# Altium project MS1-SEQ.PrjPcb (part 1 of 3)
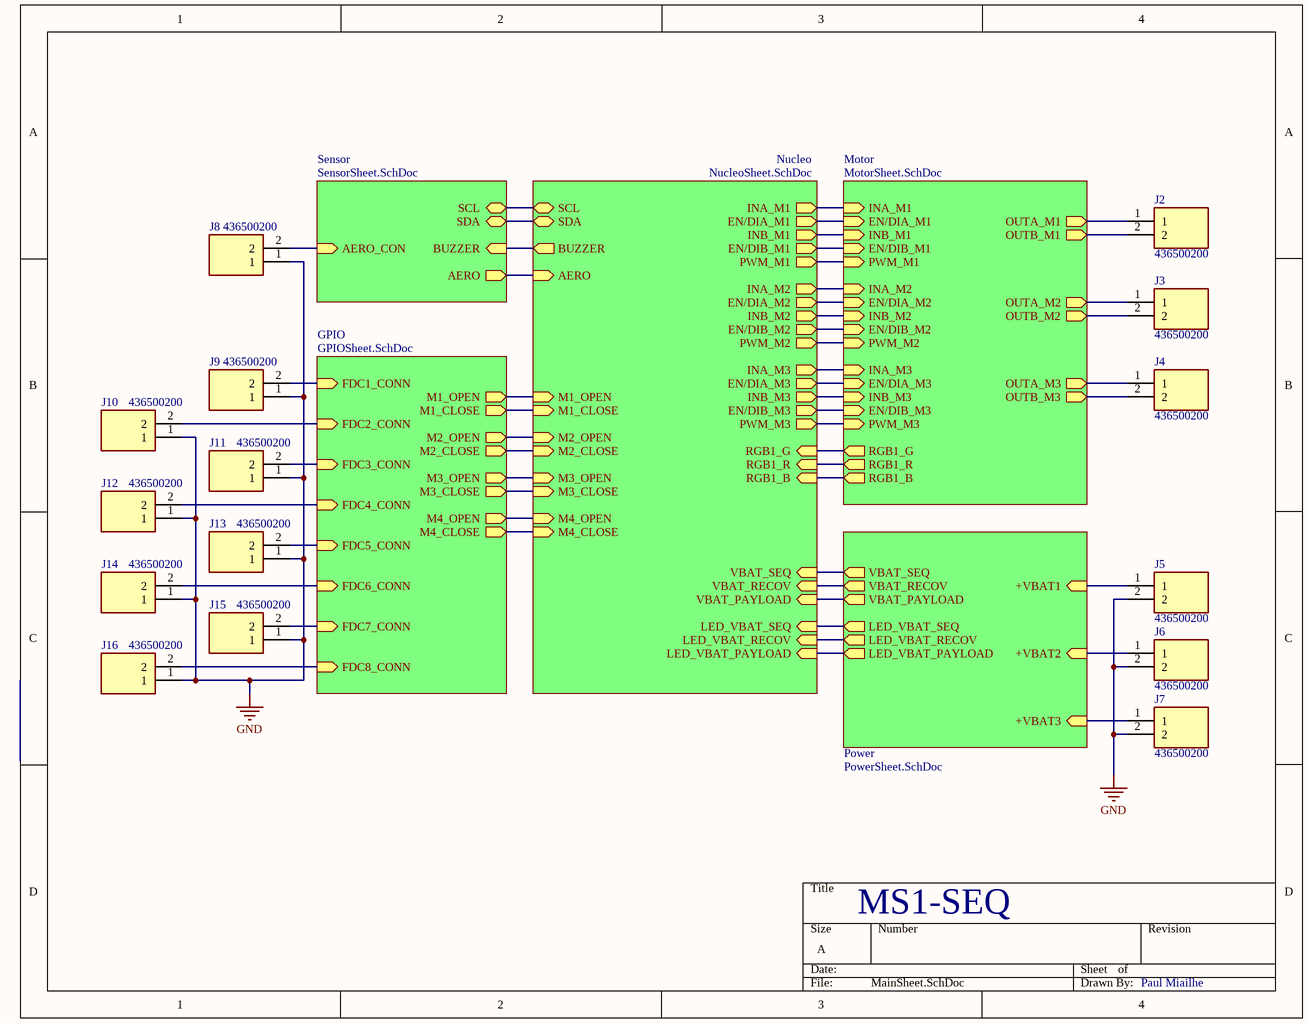
[diagram p0: MainSheet.SchDoc]
6 sheets, 184 parts. Net scope: hierarchical (ports join the sheet entries above them; power ports are global).
Board file: MS1_PCB.PcbDoc
Sheets:
  MainSheet.SchDoc
    Motor = MotorSheet.SchDoc
    Power = PowerSheet.SchDoc
    Nucleo = NucleoSheet.SchDoc
    GPIO = GPIOSheet.SchDoc
    Sensor = SensorSheet.SchDoc

## Sheet MainSheet.SchDoc
size A; SheetNumber: 1; SheetTotal: 6

### Parts
J2  436500200  [MOLEX_436500200]
J3  436500200  [MOLEX_436500200]
J4  436500200  [MOLEX_436500200]
J5  436500200  [MOLEX_436500200]
J6  436500200  [MOLEX_436500200]
J7  436500200  [MOLEX_436500200]
J8  436500200  [MOLEX_436500200]
J9  436500200  [MOLEX_436500200]
J10  436500200  [MOLEX_436500200]
J11  436500200  [MOLEX_436500200]
J12  436500200  [MOLEX_436500200]
J13  436500200  [MOLEX_436500200]
J14  436500200  [MOLEX_436500200]
J15  436500200  [MOLEX_436500200]
J16  436500200  [MOLEX_436500200]

### Sub-sheets
GPIO = GPIOSheet.SchDoc: M1_OPEN (out), M1_CLOSE (out), M2_OPEN (out), M2_CLOSE (out), M3_OPEN (out), M3_CLOSE (out), FDC1_CONN (in), FDC2_CONN (in), FDC3_CONN (in), FDC4_CONN (in), FDC5_CONN (in), FDC6_CONN (in), FDC7_CONN (in), FDC8_CONN (in), M4_CLOSE (out), M4_OPEN (out)
Motor = MotorSheet.SchDoc: INA_M1 (in), EN/DIA_M1 (in), INB_M1 (in), EN/DIB_M1 (in), PWM_M1 (in), INA_M2 (in), EN/DIA_M2 (in), INB_M2 (in), EN/DIB_M2 (in), PWM_M2 (in), INA_M3 (in), EN/DIA_M3 (in), INB_M3 (in), EN/DIB_M3 (in), PWM_M3 (in), RGB1_G (out), RGB1_R (out), RGB1_B (out), OUTA_M1 (out), OUTB_M1 (out), OUTA_M2 (out), OUTB_M2 (out), OUTA_M3 (out), OUTB_M3 (out)
Nucleo = NucleoSheet.SchDoc: EN/DIA_M1 (out), INA_M1 (out), PWM_M1 (out), EN/DIB_M1 (out), INB_M1 (out), INA_M2 (out), EN/DIA_M2 (out), INB_M2 (out), EN/DIB_M2 (out), PWM_M2 (out), INA_M3 (out), EN/DIA_M3 (out), INB_M3 (out), EN/DIB_M3 (out), PWM_M3 (out), RGB1_G (in), RGB1_R (in), RGB1_B (in), VBAT_SEQ (in), VBAT_RECOV (in), VBAT_PAYLOAD (in), LED_VBAT_SEQ (in), LED_VBAT_RECOV (in), LED_VBAT_PAYLOAD (in), M1_OPEN (in), M1_CLOSE (in), M2_OPEN (in), M2_CLOSE (in), M3_OPEN (in), M3_CLOSE (in), SCL (bidir), SDA (bidir), BUZZER (out), AERO (in), M4_OPEN (in), M4_CLOSE (in)
Power = PowerSheet.SchDoc: VBAT_SEQ (out), VBAT_RECOV (out), VBAT_PAYLOAD (out), LED_VBAT_SEQ (out), LED_VBAT_RECOV (out), LED_VBAT_PAYLOAD (out), +VBAT1 (in), +VBAT2 (in), +VBAT3 (in)
Sensor = SensorSheet.SchDoc: SCL (bidir), SDA (bidir), BUZZER (in), AERO (out), AERO_CON (in)

### Nets
GND: J5.2 J6.2 J7.2 J8.1 J9.1 J10.1 J11.1 J12.1 J13.1 J14.1 J15.1 J16.1
OUTA_M1: J2.1 ; sheet Motor/OUTA_M1
OUTA_M2: J3.1 ; sheet Motor/OUTA_M2
OUTA_M3: J4.1 ; sheet Motor/OUTA_M3
OUTB_M1: J2.2 ; sheet Motor/OUTB_M1
OUTB_M2: J3.2 ; sheet Motor/OUTB_M2
OUTB_M3: J4.2 ; sheet Motor/OUTB_M3
SCL: sheet Nucleo/SCL, sheet Sensor/SCL
SDA: sheet Nucleo/SDA, sheet Sensor/SDA
NetC25_2: sheet Power/VBAT_SEQ, sheet Nucleo/VBAT_SEQ
NetC26_2: sheet Power/VBAT_RECOV, sheet Nucleo/VBAT_RECOV
NetC27_2: sheet Power/VBAT_PAYLOAD, sheet Nucleo/VBAT_PAYLOAD
NetF1_1: J5.1 ; sheet Power/+VBAT1
NetF2_1: J6.1 ; sheet Power/+VBAT2
NetF3_1: J7.1 ; sheet Power/+VBAT3
NetJ8_2: J8.2 ; sheet Sensor/AERO_CON
NetJ9_2: J9.2 ; sheet GPIO/FDC1_CONN
NetJ10_2: J10.2 ; sheet GPIO/FDC2_CONN
NetJ11_2: J11.2 ; sheet GPIO/FDC3_CONN
NetJ12_2: J12.2 ; sheet GPIO/FDC4_CONN
NetJ13_2: J13.2 ; sheet GPIO/FDC5_CONN
NetJ14_2: J14.2 ; sheet GPIO/FDC6_CONN
NetJ15_2: J15.2 ; sheet GPIO/FDC7_CONN
NetJ16_2: J16.2 ; sheet GPIO/FDC8_CONN
NetJ101_1: sheet Motor/RGB1_G, sheet Nucleo/RGB1_G
NetJ101_2: sheet Motor/RGB1_R, sheet Nucleo/RGB1_R
NetJ101_13: sheet Nucleo/M4_OPEN, sheet GPIO/M4_OPEN
NetJ101_15: sheet Nucleo/M4_CLOSE, sheet GPIO/M4_CLOSE
NetJ101_17: sheet Motor/RGB1_B, sheet Nucleo/RGB1_B
NetJ101_27: sheet Nucleo/BUZZER, sheet Sensor/BUZZER
NetJ101_31: sheet Nucleo/AERO, sheet Sensor/AERO
NetJ101_32: sheet Nucleo/M3_OPEN, sheet GPIO/M3_OPEN
NetJ101_34: sheet Motor/EN/DIA_M3, sheet Nucleo/EN/DIA_M3
NetJ101_35: sheet Power/LED_VBAT_RECOV, sheet Nucleo/LED_VBAT_RECOV
NetJ101_36: sheet Power/LED_VBAT_SEQ, sheet Nucleo/LED_VBAT_SEQ
NetJ101_37: sheet Power/LED_VBAT_PAYLOAD, sheet Nucleo/LED_VBAT_PAYLOAD
NetJ102_1: sheet Motor/INB_M1, sheet Nucleo/INB_M1
NetJ102_2: sheet Motor/EN/DIA_M1, sheet Nucleo/EN/DIA_M1
NetJ102_4: sheet Motor/PWM_M2, sheet Nucleo/PWM_M2
NetJ102_6: sheet Motor/EN/DIB_M3, sheet Nucleo/EN/DIB_M3
NetJ102_11: sheet Nucleo/M2_CLOSE, sheet GPIO/M2_CLOSE
NetJ102_13: sheet Nucleo/M2_OPEN, sheet GPIO/M2_OPEN
NetJ102_15: sheet Nucleo/M1_CLOSE, sheet GPIO/M1_CLOSE
NetJ102_16: sheet Motor/EN/DIB_M2, sheet Nucleo/EN/DIB_M2
NetJ102_19: sheet Motor/EN/DIB_M1, sheet Nucleo/EN/DIB_M1
NetJ102_21: sheet Motor/PWM_M1, sheet Nucleo/PWM_M1
NetJ102_22: sheet Motor/INA_M3, sheet Nucleo/INA_M3
NetJ102_23: sheet Motor/INA_M1, sheet Nucleo/INA_M1
NetJ102_24: sheet Motor/INB_M3, sheet Nucleo/INB_M3
NetJ102_25: sheet Motor/PWM_M3, sheet Nucleo/PWM_M3
NetJ102_26: sheet Motor/INA_M2, sheet Nucleo/INA_M2
NetJ102_28: sheet Motor/INB_M2, sheet Nucleo/INB_M2
NetJ102_30: sheet Motor/EN/DIA_M2, sheet Nucleo/EN/DIA_M2
NetJ102_34: sheet Nucleo/M1_OPEN, sheet GPIO/M1_OPEN
NetJ102_37: sheet Nucleo/M3_CLOSE, sheet GPIO/M3_CLOSE

### Notes on the sheet
- MS1-SEQ
- Paul Miailhe

### Library data of the parts
J2-J16 = 436500200: MF: {'manufacturer': u'Molex'}; Availability: Unavailable; Price: None; Package: None; Value: *; MP: 436500200

## Sheet MotorSheet.SchDoc
size A4; SheetNumber: 2; SheetTotal: 6
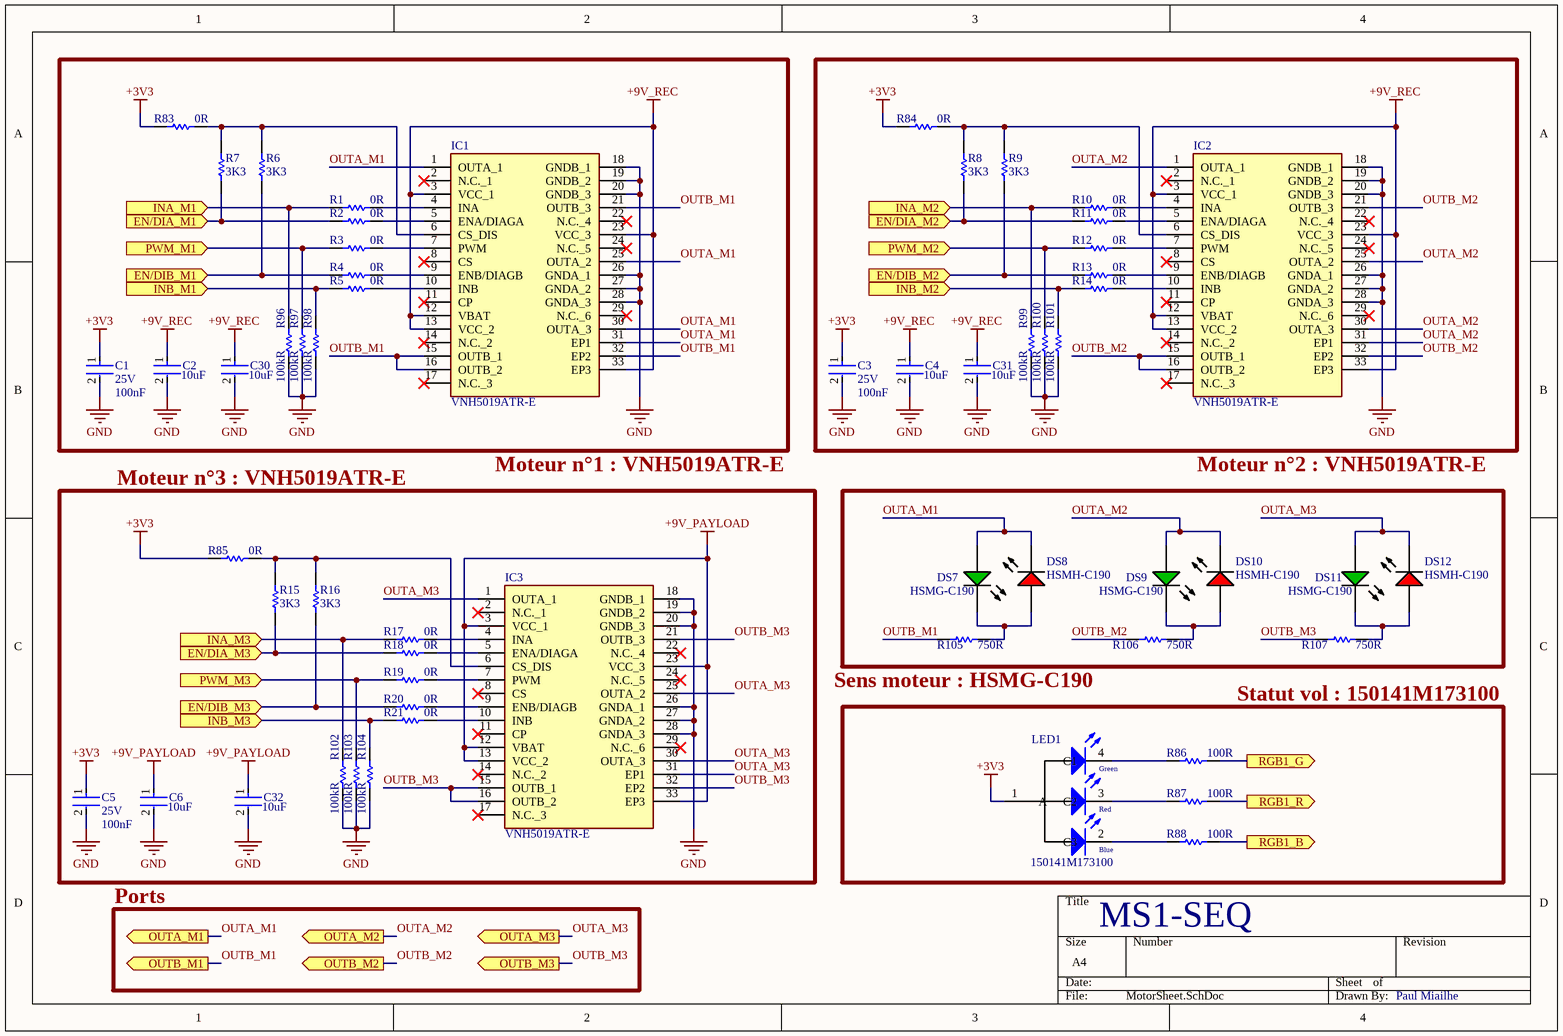
[diagram p1: MotorSheet.SchDoc]

### Parts
C1  Voltage Rating (DC): 25V  Capacitance: 100nF  [FP-CGA3E-0_3-0_1-MFG]  (hidden comment: CGA3E2X7R1E104K080AA)
C2  Capacitance: 10uF  [FP-GRM31C-0_2-e0_3_0_8-MFG]  (hidden comment: GRM31CR71E106KA12L)
C3  Voltage Rating (DC): 25V  Capacitance: 100nF  [FP-CGA3E-0_3-0_1-MFG]  (hidden comment: CGA3E2X7R1E104K080AA)
C4  Capacitance: 10uF  [FP-GRM31C-0_2-e0_3_0_8-MFG]  (hidden comment: GRM31CR71E106KA12L)
C5  Voltage Rating (DC): 25V  Capacitance: 100nF  [FP-CGA3E-0_3-0_1-MFG]  (hidden comment: CGA3E2X7R1E104K080AA)
C6  Capacitance: 10uF  [FP-GRM31C-0_2-e0_3_0_8-MFG]  (hidden comment: GRM31CR71E106KA12L)
C30  Capacitance: 10uF  [FP-GRM31C-0_2-e0_3_0_8-MFG]  (hidden comment: GRM31CR71E106KA12L)
C31  Capacitance: 10uF  [FP-GRM31C-0_2-e0_3_0_8-MFG]  (hidden comment: GRM31CR71E106KA12L)
C32  Capacitance: 10uF  [FP-GRM31C-0_2-e0_3_0_8-MFG]  (hidden comment: GRM31CR71E106KA12L)
DS7  HSMG-C190  [AVAG-HSMX-C190_V]
DS8  HSMH-C190  [AVAG-HSMX-C190_V]
DS9  HSMG-C190  [AVAG-HSMX-C190_V]
DS10  HSMH-C190  [AVAG-HSMX-C190_V]
DS11  HSMG-C190  [AVAG-HSMX-C190_V]
DS12  HSMH-C190  [AVAG-HSMX-C190_V]
IC1  VNH5019ATR-E  [VNH5019A-E_1]
IC2  VNH5019ATR-E  [VNH5019A-E_1]
IC3  VNH5019ATR-E  [VNH5019A-E_1]
LED1  150141M173100  [3528_A]
R1  0R  [RESC1608X55X25ML10T15]
R2  0R  [RESC1608X55X25ML10T15]
R3  0R  [RESC1608X55X25ML10T15]
R4  0R  [RESC1608X55X25ML10T15]
R5  0R  [RESC1608X55X25ML10T15]
R6  3K3  [RESC1608X55X25ML10T15]
R7  3K3  [RESC1608X55X25ML10T15]
R8  3K3  [RESC1608X55X25ML10T15]
R9  3K3  [RESC1608X55X25ML10T15]
R10  0R  [RESC1608X55X25ML10T15]
R11  0R  [RESC1608X55X25ML10T15]
R12  0R  [RESC1608X55X25ML10T15]
R13  0R  [RESC1608X55X25ML10T15]
R14  0R  [RESC1608X55X25ML10T15]
R15  3K3  [RESC1608X55X25ML10T15]
R16  3K3  [RESC1608X55X25ML10T15]
R17  0R  [RESC1608X55X25ML10T15]
R18  0R  [RESC1608X55X25ML10T15]
R19  0R  [RESC1608X55X25ML10T15]
R20  0R  [RESC1608X55X25ML10T15]
R21  0R  [RESC1608X55X25ML10T15]
R83  0R  [RESC1608X55X25ML10T15]
R84  0R  [RESC1608X55X25ML10T15]
R85  0R  [RESC1608X55X25ML10T15]
R86  Resistance: 100R  [RESC1608X55X30LL15T15]  (hidden comment: ERJ-3EKF1000V)
R87  Resistance: 100R  [RESC1608X55X30LL15T15]  (hidden comment: ERJ-3EKF1000V)
R88  Resistance: 100R  [RESC1608X55X30LL15T15]  (hidden comment: ERJ-3EKF1000V)
R96  Resistance: 100kR  [RESC1608X55X30ML20T20]  (hidden comment: ERA3AEB104V)
R97  Resistance: 100kR  [RESC1608X55X30ML20T20]  (hidden comment: ERA3AEB104V)
R98  Resistance: 100kR  [RESC1608X55X30ML20T20]  (hidden comment: ERA3AEB104V)
R99  Resistance: 100kR  [RESC1608X55X30ML20T20]  (hidden comment: ERA3AEB104V)
R100  Resistance: 100kR  [RESC1608X55X30ML20T20]  (hidden comment: ERA3AEB104V)
R101  Resistance: 100kR  [RESC1608X55X30ML20T20]  (hidden comment: ERA3AEB104V)
R102  Resistance: 100kR  [RESC1608X55X30ML20T20]  (hidden comment: ERA3AEB104V)
R103  Resistance: 100kR  [RESC1608X55X30ML20T20]  (hidden comment: ERA3AEB104V)
R104  Resistance: 100kR  [RESC1608X55X30ML20T20]  (hidden comment: ERA3AEB104V)
R105  Resistance: 750R  [RESC1608X55X30ML20T20]  (hidden comment: ERA-3AEB751V)
R106  Resistance: 750R  [RESC1608X55X30ML20T20]  (hidden comment: ERA-3AEB751V)
R107  Resistance: 750R  [RESC1608X55X30ML20T20]  (hidden comment: ERA-3AEB751V)

### Blocks framed on the sheet
Moteur n°3 : VNH5019ATR-E: C5 C6 C32 IC3 R15-R21 R85 R102-R104
Statut vol : 150141M173100: LED1 R86-R88

### Ports
EN/DIA_M1 (in), EN/DIA_M2 (in), EN/DIA_M3 (in), EN/DIB_M1 (in), EN/DIB_M2 (in), EN/DIB_M3 (in), INA_M1 (in), INA_M2 (in), INA_M3 (in), INB_M1 (in), INB_M2 (in), INB_M3 (in), OUTA_M1 (out), OUTA_M2 (out), OUTA_M3 (out), OUTB_M1 (out), OUTB_M2 (out), OUTB_M3 (out), PWM_M1 (in), PWM_M2 (in), PWM_M3 (in), RGB1_B (out), RGB1_G (out), RGB1_R (out)

### Nets
+3V3: C1.1 C3.1 C5.1 LED1.1(A) R83.1 R84.1 R85.1
+9V_PAYLOAD: C6.1 C32.1 IC3.3(VCC_1) IC3.12(VBAT) IC3.13(VCC_2) IC3.23(VCC_3) IC3.33(EP3)
+9V_REC: C2.1 C4.1 C30.1 C31.1 IC1.3(VCC_1) IC1.12(VBAT) IC1.13(VCC_2) IC1.23(VCC_3) IC1.33(EP3) IC2.3(VCC_1) IC2.12(VBAT) IC2.13(VCC_2) IC2.23(VCC_3) IC2.33(EP3)
GND: C1.2 C2.2 C3.2 C4.2 C5.2 C6.2 C30.2 C31.2 C32.2 IC1.18(GNDB_1) IC1.19(GNDB_2) IC1.20(GNDB_3) IC1.26(GNDA_1) IC1.27(GNDA_2) IC1.28(GNDA_3) IC2.18(GNDB_1) IC2.19(GNDB_2) IC2.20(GNDB_3) IC2.26(GNDA_1) IC2.27(GNDA_2) IC2.28(GNDA_3) IC3.18(GNDB_1) IC3.19(GNDB_2) IC3.20(GNDB_3) IC3.26(GNDA_1) IC3.27(GNDA_2) IC3.28(GNDA_3) R96.1 R97.1 R98.1 R99.1 R100.1 R101.1 R102.1 R103.1 R104.1
OUTA_M1: DS7.1(A) DS8.2(K) IC1.1(OUTA_1) IC1.25(OUTA_2) IC1.30(OUTA_3) IC1.31(EP1) ; port OUTA_M1
OUTA_M2: DS9.1(A) DS10.2(K) IC2.1(OUTA_1) IC2.25(OUTA_2) IC2.30(OUTA_3) IC2.31(EP1) ; port OUTA_M2
OUTA_M3: DS11.1(A) DS12.2(K) IC3.1(OUTA_1) IC3.25(OUTA_2) IC3.30(OUTA_3) IC3.31(EP1) ; port OUTA_M3
OUTB_M1: IC1.15(OUTB_1) IC1.16(OUTB_2) IC1.21(OUTB_3) IC1.32(EP2) R105.1 ; port OUTB_M1
OUTB_M2: IC2.15(OUTB_1) IC2.16(OUTB_2) IC2.21(OUTB_3) IC2.32(EP2) R106.1 ; port OUTB_M2
OUTB_M3: IC3.15(OUTB_1) IC3.16(OUTB_2) IC3.21(OUTB_3) IC3.32(EP2) R107.1 ; port OUTB_M3
NetDS7_2: DS7.2(K) DS8.1(A) R105.2
NetDS9_2: DS9.2(K) DS10.1(A) R106.2
NetDS11_2: DS11.2(K) DS12.1(A) R107.2
NetIC1_4: IC1.4(INA) R1.2
NetIC1_5: IC1.5(ENA/DIAGA) R2.2
NetIC1_6: IC1.6(CS_DIS) R6.2 R7.2 R83.2
NetIC1_7: IC1.7(PWM) R3.2
NetIC1_9: IC1.9(ENB/DIAGB) R4.2
NetIC1_10: IC1.10(INB) R5.2
NetIC2_4: IC2.4(INA) R10.2
NetIC2_5: IC2.5(ENA/DIAGA) R11.2
NetIC2_6: IC2.6(CS_DIS) R8.2 R9.2 R84.2
NetIC2_7: IC2.7(PWM) R12.2
NetIC2_9: IC2.9(ENB/DIAGB) R13.2
NetIC2_10: IC2.10(INB) R14.2
NetIC3_4: IC3.4(INA) R17.2
NetIC3_5: IC3.5(ENA/DIAGA) R18.2
NetIC3_6: IC3.6(CS_DIS) R15.2 R16.2 R85.2
NetIC3_7: IC3.7(PWM) R19.2
NetIC3_9: IC3.9(ENB/DIAGB) R20.2
NetIC3_10: IC3.10(INB) R21.2
NetJ101_1: R86.1 ; port RGB1_G
NetJ101_2: R87.1 ; port RGB1_R
NetJ101_17: R88.1 ; port RGB1_B
NetJ101_34: R15.1 R18.1 ; port EN/DIA_M3
NetJ102_1: R5.1 R98.2 ; port INB_M1
NetJ102_2: R2.1 R7.1 ; port EN/DIA_M1
NetJ102_4: R12.1 R100.2 ; port PWM_M2
NetJ102_6: R16.1 R20.1 ; port EN/DIB_M3
NetJ102_16: R9.1 R13.1 ; port EN/DIB_M2
NetJ102_19: R4.1 R6.1 ; port EN/DIB_M1
NetJ102_21: R3.1 R97.2 ; port PWM_M1
NetJ102_22: R17.1 R102.2 ; port INA_M3
NetJ102_23: R1.1 R96.2 ; port INA_M1
NetJ102_24: R21.1 R104.2 ; port INB_M3
NetJ102_25: R19.1 R103.2 ; port PWM_M3
NetJ102_26: R10.1 R99.2 ; port INA_M2
NetJ102_28: R14.1 R101.2 ; port INB_M2
NetJ102_30: R8.1 R11.1 ; port EN/DIA_M2
NetLED1_2: LED1.2(C3) R88.2
NetLED1_3: LED1.3(C2) R87.2
NetLED1_4: LED1.4(C1) R86.2

Not connected (* = marked no-connect by the designer): IC1 2(N.C._1)* 8(CS)* 11(CP)* 14(N.C._2)* 17(N.C._3)* 22(N.C._4)* 24(N.C._5)* 29(N.C._6)*; IC2 2(N.C._1)* 8(CS)* 11(CP)* 14(N.C._2)* 17(N.C._3)* 22(N.C._4)* 24(N.C._5)* 29(N.C._6)*; IC3 2(N.C._1)* 8(CS)* 11(CP)* 14(N.C._2)* 17(N.C._3)* 22(N.C._4)* 24(N.C._5)* 29(N.C._6)*

### Notes on the sheet
- Moteur n°1 : VNH5019ATR-E
- Moteur n°2 : VNH5019ATR-E
- (near R105) Sens moteur : HSMG-C190
- Ports
- MS1-SEQ
- Paul Miailhe
- (in symbol CMP-1431-00001-1) Green; Red; Blue

### Library data of the parts
C1 C3 C5 = CMP-08246-002186-1: Cap Ceramic 100nF 25V X7R 10% Pad SMD 0603 +125°C Automotive T/R; Manufacturer: TDK; Composition: Ceramic; Dielectric: X7R; Ratings: AEC-Q200; Length: 1.6mm; REACH SVHC: No SVHC; Width: 0.031inch; Packaging: Tape and Reel; Case/Package: 0603; Height: 0.8mm; Termination: SMD/SMT; Max Operating Temperature: 125°C; Thickness: 0.035inch; Case Code (Metric): 1608; Lead Free: Lead Free; Mount: Surface Mount; Voltage Rating: 25V; Tolerance: 10%; Weight: 7.1E-05oz; Min Operating Temperature: -55°C; Package Quantity: 1; Depth: 0.8mm; Case Code (Imperial): 0603; Supplier 1: Mouser; Supplier Part Number 1: 810-CGA3E2X7R1E104K; Manufacturer Part Number: CGA3E2X7R1E104K080AA; RoHS: Yes; Category: Ceramic Capacitors; Stock 1: 488891; Pricing 1: 1=0,12000, 10=0,05600, 50=0,05600, 100=0,02500, 1000=0,01400, 10000=0,01000 (USD); Series: CGA; Resistor Type: Ceramic; RoHS Compliant: Yes; ComponentLink1URL: https://datasheet.ciiva.com/24220/cga3e2x7r1e104k080aa-265934-24220022.pdf?src-supplier=Mouser; ComponentLink1Description: https://datasheet.ciiva.com/24220/cga3e2x7r1e104k080aa-265934-24220022.pdf?src-supplier=Mouser; ComponentLink2URL: https://datasheet.ciiva.com/22725/1735392-22725638.pdf?src-supplier=Element14; ComponentLink2Description: https://datasheet.ciiva.com/22725/1735392-22725638.pdf?src-supplier=Element14; ComponentLink3URL: https://datasheet.ciiva.com/22725/1735392-22725639.pdf?src-supplier=Element14; ComponentLink3Description: https://datasheet.ciiva.com/22725/1735392-22725639.pdf?src-supplier=Element14; ComponentLink4URL: https://datasheet.ciiva.com/16427/mlccspec-automotive-general-midvoltage-en-16427320.pdf?src-supplier=Future+Electronics; ComponentLink4Description: https://datasheet.ciiva.com/16427/mlccspec-automotive-general-midvoltage-en-16427320.pdf?src-supplier=Future+Electronics; ComponentLink5URL: https://datasheet.ciiva.com/23803/1735392-23803082.pdf?src-supplier=Newark; ComponentLink5Description: https://datasheet.ciiva.com/23803/1735392-23803082.pdf?src-supplier=Newark
C2 C4 C6 C30-C32 = CMP-06035-003589-1: Chip Multilayer Ceramic Capacitors for General Purpose, 1206, 10uF, X7R, 15%, 10%, 25V; Manufacturer: Murata; Description: CAP CER 10UF 25V 10% X7R 1206; Case Code (Imperial): 1206; Voltage Rating (DC): 25V; Voltage Rating: 25V; Length: 3.2mm; Lead Free: Lead Free; Thickness: 0.071inch; Package Quantity: 1; Width: 1.6mm; Max Operating Temperature: 125°C; Number of Pins: 2; Height: 1.6mm; Case Code (Metric): 3216; REACH SVHC: No SVHC; Radiation Hardening: No; Case/Package: 1206; Material: Ceramic; Tolerance: 10%; Voltage: 25V; Mount: Surface Mount; Packaging: Tape and Reel; Dielectric: X7R; Termination: SMD/SMT; Min Operating Temperature: -55°C; Depth: 1.6mm; Supplier 1: Arrow Electronics; Supplier Part Number 1: GRM31CR71E106KA12L; Manufacturer Part Number: GRM31CR71E106KA12L; RoHS: Yes; Category: Ceramic Capacitors; Stock 1: 64000; Pricing 1: 2000=0.15670 (USD); Series: GRM; Construction: Flat; RoHS Compliant: Yes; ComponentLink1URL: https://datasheet.ciiva.com/22746/415311-22746465.pdf?src-supplier=Element14; ComponentLink1Description: https://datasheet.ciiva.com/22746/415311-22746465.pdf?src-supplier=Element14; ComponentLink2URL: https://datasheet.ciiva.com/22703/1747484-22703378.pdf?src-supplier=Element14; ComponentLink2Description: https://datasheet.ciiva.com/22703/1747484-22703378.pdf?src-supplier=Element14; ComponentLink3URL: https://datasheet.ciiva.com/11789/0900766b80ef921d-11789064.pdf?src-supplier=RSComponents; ComponentLink3Description: https://datasheet.ciiva.com/11789/0900766b80ef921d-11789064.pdf?src-supplier=RSComponents; ComponentLink4URL: https://datasheet.ciiva.com/5418/product-5418961.pdf?src-supplier=Mouser; ComponentLink4Description: https://datasheet.ciiva.com/5418/product-5418961.pdf?src-supplier=Mouser; ComponentLink5URL: https://datasheet.ciiva.com/3777/4378grm31cr71e106ka1223-3777275.pdf?src-supplier=Arrow+Electronics; ComponentLink5Description: https://datasheet.ciiva.com/3777/4378grm31cr71e106ka1223-3777275.pdf?src-supplier=Arrow+Electronics; ComponentLink6URL: https://datasheet.ciiva.com/29202/451104-da-01-de-vs-chip-kond-1206-10-0-uf-10pr-25-0v-x7r-29202596.pdf?src-supplier=Conrad; ComponentLink6Description: https://datasheet.ciiva.com/29202/451104-da-01-de-vs-chip-kond-1206-10-0-uf-10pr-25-0v-x7r-29202596.pdf?src-supplier=Conrad; ComponentLink7URL: https://datasheet.ciiva.com/29199/454935-da-01-en-vs-kondensator-1206-29199424.pdf?src-supplier=Conrad; ComponentLink7Description: https://datasheet.ciiva.com/29199/454935-da-01-en-vs-kondensator-1206-29199424.pdf?src-supplier=Conrad; ComponentLink8URL: https://datasheet.ciiva.com/14116/grmseries-highdielectrictype-eng-14116377.pdf?src-supplier=Distrelec; ComponentLink8Description: https://datasheet.ciiva.com/14116/grmseries-highdielectrictype-eng-14116377.pdf?src-supplier=Distrelec; ComponentLink9URL: https://datasheet.ciiva.com/22774/415311-22774043.pdf?src-supplier=Farnell; ComponentLink9Description: https://datasheet.ciiva.com/22774/415311-22774043.pdf?src-supplier=Farnell; ComponentLink10URL: https://datasheet.ciiva.com/22774/415311-22774044.pdf?src-supplier=Farnell; ComponentLink10Description: https://datasheet.ciiva.com/22774/415311-22774044.pdf?src-supplier=Farnell; ComponentLink11URL: https://datasheet.ciiva.com/6264/partnumbering-e-01-6264460.pdf?src-supplier=Digi-Key; ComponentLink11Description: https://datasheet.ciiva.com/6264/partnumbering-e-01-6264460.pdf?src-supplier=Digi-Key; ComponentLink12URL: https://datasheet.ciiva.com/6264/partnumbering-e-01-6264458.pdf?src-supplier=Digi-Key; ComponentLink12Description: https://datasheet.ciiva.com/6264/partnumbering-e-01-6264458.pdf?src-supplier=Digi-Key; ComponentLink13URL: https://datasheet.ciiva.com/6264/partnumbering-e-01-6264462.pdf?src-supplier=Digi-Key; ComponentLink13Description: https://datasheet.ciiva.com/6264/partnumbering-e-01-6264462.pdf?src-supplier=Digi-Key; ComponentLink14URL: https://datasheet.ciiva.com/16210/partnumbering-e-01-16210776.pdf?src-supplier=Future+Electronics; ComponentLink14Description: https://datasheet.ciiva.com/16210/partnumbering-e-01-16210776.pdf?src-supplier=Future+Electronics
DS7 DS9 DS11 = CMP-1744-00002-1: Chip LED, Green, 2.2 V, -40 to 85 degC, 2-Pin SMD, RoHS, Tape and Reel; Frequency: 400 KHz; Max Supply Voltage: 5.5 V; Access Time: 3500 ns; Clock Frequency: 100 KHz; Case\Package: SOIC; Density: 32 kb; Nominal Supply Current: 2 mA; Interface: Serial; Min Supply Voltage: 1.7 V; Packaging: Tape and Reel; PackageReference: HSMX-C190; ComponentLink2URL: http://docs.avagotech.com/docs/AV02-0551EN; RoHSCompliant: true; Pins: 8; REACH SVHC: No SVHC; Max Operating Temperature: 85 degC; Width: 4 mm; Radiation Hardening: No; Package Quantity: 3000; ComponentLink3Description: Package Specification; ComponentLink1Description: Manufacturer URL; Min Operating Temperature: -40 degC; PackageDescription: 2-Pin Surface Mount Device, Body 1.6 x 0.8 mm, Height 0.9 mm; Max Clock Frequency: 100 KHz; Height: 1.5 mm; ComponentLink1URL: http://www.avagotech.com/; DatasheetVersion: Mar-12; ComponentLink2Description: Datasheet; Mount: Surface Mount; Length: 5 mm; ComponentLink3URL: http://www.fairchildsemi.com/dwg/MA/MA03D.pdf
DS8 DS10 DS12 = CMP-1744-00004-1: LED Uni-Color Red, 65 mW, 20 mA, -40 to 85 degC, 2-Pin SMD, RoHS, Tape and Reel; Connector Type: USB; Gender: Male; Current Rating: 1 A; Length: 7.5 mm; Lead Pitch: 0.65 mm; PackageReference: HSMX-C190; Package Quantity: 2000; Max Operating Temperature: 85 degC; PackageDescription: 2-Pin Surface Mount Device, Body 1.6 x 0.8 mm, Height 0.9 mm; ComponentLink3Description: Package Specification; Mount: Surface Mount; Min Operating Temperature: -30 degC; ComponentLink3URL: http://www.fairchildsemi.com/dwg/MA/MA03D.pdf; ComponentLink1Description: Manufacturer URL; Contact Material: Copper; Pins: 5; Width: 5.6 mm; ComponentLink2Description: Datasheet; RoHSCompliant: true; DatasheetVersion: Mar-12; Height: 2.8 mm; Packaging: Tape and Reel; Contact Plating: Gold; ComponentLink1URL: http://www.avagotech.com/; REACH SVHC: No SVHC; ComponentLink2URL: http://docs.avagotech.com/docs/AV02-0551EN
IC1-IC3 = VNH5019ATR-E: Integrated Circuit; Manufacturer_Name: STMicroelectronics; Datasheet Link: https://www.st.com/resource/en/datasheet/vnh5019a-e.pdf; Manufacturer_Part_Number: VNH5019ATR-E; Mouser Part Number: 511-VNH5019ATR-E; Mouser Price/Stock: https://www.mouser.co.uk/ProductDetail/STMicroelectronics/VNH5019ATR-E?qs=T%2FOtf55vL7cDceYVZzSNKw%3D%3D; Arrow Part Number: VNH5019ATR-E; Arrow Price/Stock: https://www.arrow.com/en/products/vnh5019atr-e/stmicroelectronics
LED1 = CMP-1431-00001-1: SMD Full-Color Top LED, WL-SFTW, Red & Green & Blue; Manufacturer: Wuerth Elektronik; PackageReference: 3528_A; PartNumber: 150141M173100; ComponentLink2Description: Datasheet; ComponentLink1URL: http://www.we-online.com; Color: Red & Green & Blue; ComponentLink1Description: Manufacturer URL; ComponentLink2URL: http://katalog.we-online.com/led/datasheet/150141M173100.pdf
R1-R5 R10-R14 R17-R21 R83-R85 = CMP-2100-03667-1: Chip Resistor, 0 Ohm, +/- 5%, 0.1 W, -55 to 155 degC, 0603 (1608 Metric), RoHS, Tape and Reel; Manufacturer: Yageo; Temperature Coefficient: 200ppm/degreesC; Voltage Rating: 50V; Power Rating: 100mW; Resistance: 0mOhm; Width: 0.8mm; Max Operating Temperature: 155degC; Tolerance: 5%; Package Reference: 0603; Height: 0.45mm; Depth: 0.8mm; Package Description: 2-Pin Surface Mount Device, Body 1.6 x 0.8 mm; Termination: SMD/SMT; Package Quantity: 5000; Case/Package: 0603; Case Code (Imperial): 0603; Radiation Hardening: No; Number of Pins: 2; Length: 1.6mm; Lead Free: LeadFree; Voltage Rating (DC): 50V; Military Standard: Not; Datasheet URL: http://www.yageo.com/NewPortal/yageodocoutput?fileName=/pdf/R-Chip/PYu-RC_Group_51_RoHS_L_5.pdf; Manufacturer URL: http://www.yageo.com/; Packaging: TapeandReel; Case Code (Metric): 1608; Min Operating Temperature: -55degC; Composition: ThickFilm; RoHSCompliant: true; Contact Plating: Tin; Datasheet Version: Rev. 5, 10/2016; REACH SVHC: NoSVHC
R6-R9 R15 R16 = CMP-1012-00567-2: Chip Resistor, 3.3 KOhm, +/- 1%, 0.1 W, -55 to 155 degC, 0603 (1608 Metric), RoHS, Tape and Reel; Manufacturer: Yageo; Temperature Coefficient: 100ppm/degreesC; Voltage Rating: 50V; Max Power Dissipation: 100mW; Resistance: 3.3KOhm; Case Code (Metric): 1608; Case/Package: 0603; Composition: ThickFilm; RoHSCompliant: true; Datasheet Version: Rev. 5, 10/2016; REACH SVHC: NoSVHC; Width: 0.8mm; Package Quantity: 1; Depth: 0.8mm; Voltage Rating (DC): 50V; Termination: SMD/SMT; Length: 1.6mm; Lead Free: LeadFree; Package Description: 2-Pin Surface Mount Device, Body 1.6 x 0.8 mm; Max Operating Temperature: 155degC; Tolerance: 1%; Height: 0.45mm; Number of Pins: 2; Military Standard: Not; Power Rating: 100mW; Datasheet URL: http://www.yageo.com/NewPortal/yageodocoutput?fileName=/pdf/R-Chip/PYu-RC_Group_51_RoHS_L_5.pdf; Case Code (Imperial): 0603; Manufacturer URL: http://www.yageo.com/; Packaging: TapeandReel; Min Operating Temperature: -55degC; Package Reference: 0603; Number of Terminations: 2
R86-R88 = CMP-2000-00179-1: Manufacturer: Panasonic; Manufacturer Part Number: ERJ3EKF1000V; Tolerance: 1%; Power Rating: 100mW; Voltage Rating: 75V; Temperature Coefficient: 100ppm/°C; Part Number: ERJ-3EKF1000V; Supplier 1: RSComponents; Supplier Part Number 1: 1755733; RoHS: Yes; Category: Chip SMD Resistors; Stock 1: 30000; Pricing 1: 5000=0,01000, 10000=0,00800, 15000=0,00800, 20000=0,00800, 5000=0,00700, 10000=0,00600, 15000=0,00600, 20000=0,00600 (USD); Mount: Surface Mount; Number of Pins: 2; Case Code (Imperial): 0603; Case Code (Metric): 1608; Weight: 7.1E-05oz; Contact Plating: Tin; Size Code: 0603; Min Operating Temperature: -55°C; Max Operating Temperature: 155°C; Packaging: Tape and Reel; Termination: SMD/SMT; Resistor Type: Thick Film; Number of Terminations: 2; Series: ERJ; Package Quantity: 5000; Max Power Dissipation: 100mW; Voltage Rating (DC): 75V; Resistance Tolerance: 1%; Construction: Rectangular; Features: Automotive AEC-Q200; Length: 1.6mm; Width: 0.8mm; Height: 0.45mm; Depth: 0.8mm; Radiation Hardening: No; REACH SVHC: No SVHC; RoHS Compliant: Yes; Military Standard: Not; Lead Free: Lead Free; ComponentLink1URL: https://datasheet.ciiva.com/34303/1987450-34303565.pdf?src-supplier=Jameco; ComponentLink1Description: https://datasheet.ciiva.com/34303/1987450-34303565.pdf?src-supplier=Jameco; ComponentLink2URL: https://datasheet.ciiva.com/7830/aoa0000ce2-7830728.pdf?src-supplier=Element14; ComponentLink2Description: https://datasheet.ciiva.com/7830/aoa0000ce2-7830728.pdf?src-supplier=Element14; ComponentLink3URL: https://datasheet.ciiva.com/46372/1678782-46372726.pdf?src-supplier=Element14; ComponentLink3Description: https://datasheet.ciiva.com/46372/1678782-46372726.pdf?src-supplier=Element14; ComponentLink4URL: https://datasheet.ciiva.com/22667/1678782-22667887.pdf?src-supplier=Element14; ComponentLink4Description: https://datasheet.ciiva.com/22667/1678782-22667887.pdf?src-supplier=Element14; ComponentLink5URL: https://datasheet.ciiva.com/46372/1678782-46372727.pdf?src-supplier=Element14; ComponentLink5Description: https://datasheet.ciiva.com/46372/1678782-46372727.pdf?src-supplier=Element14; ComponentLink6URL: https://datasheet.ciiva.com/24159/aoa0000ce2-24159753.pdf?src-supplier=Mouser; ComponentLink6Description: https://datasheet.ciiva.com/24159/aoa0000ce2-24159753.pdf?src-supplier=Mouser; ComponentLink7URL: https://datasheet.ciiva.com/16762/70260748-16762666.pdf?src-supplier=Allied+Electronics; ComponentLink7Description: https://datasheet.ciiva.com/16762/70260748-16762666.pdf?src-supplier=Allied+Electronics; ComponentLink8URL: https://datasheet.ciiva.com/16765/70260748-16765766.pdf?src-supplier=Allied+Electronics; ComponentLink8Description: https://datasheet.ciiva.com/16765/70260748-16765766.pdf?src-supplier=Allied+Electronics; ComponentLink9URL: https://datasheet.ciiva.com/9186/aoa0000ce2-9186725.pdf?src-supplier=Avnet; ComponentLink9Description: https://datasheet.ciiva.com/9186/aoa0000ce2-9186725.pdf?src-supplier=Avnet; ComponentLink10URL: https://datasheet.ciiva.com/48530/aoa0000ce2-48530986.pdf?src-supplier=Avnet; ComponentLink10Description: https://datasheet.ciiva.com/48530/aoa0000ce2-48530986.pdf?src-supplier=Avnet; ComponentLink11URL: https://datasheet.ciiva.com/30088/aoa0000ce2-30088649.pdf?src-supplier=Onlinecomponents.com; ComponentLink11Description: https://datasheet.ciiva.com/30088/aoa0000ce2-30088649.pdf?src-supplier=Onlinecomponents.com; ComponentLink12URL: https://datasheet.ciiva.com/17207/aoa0000ce2-17207983.pdf?src-supplier=Avnet+Europe; ComponentLink12Description: https://datasheet.ciiva.com/17207/aoa0000ce2-17207983.pdf?src-supplier=Avnet+Europe
R96-R104 = CMP-2000-00875-1: Manufacturer: Panasonic; Manufacturer Part Number: ERA-3AEB104V; Tolerance: 0.1%; Temperature Coefficient: 25ppm/°C; Voltage Rating: 75V; Power Rating: 100mW; Part Number: ERA3AEB104V; Supplier 1: RSComponents; Supplier Part Number 1: 0566787; RoHS: Yes; Category: Chip SMD Resistors; Stock 1: 29; Pricing 1: 5=0.39000, 50=0.36200, 100=0.33800, 250=0.31600, 500=0.28800 (GBP); Mount: Surface Mount; Case/Package: 0603; Number of Pins: 2; Case Code (Metric): 1608; Case Code (Imperial): 0603; Contact Plating: Tin; Min Operating Temperature: -55°C; Max Operating Temperature: 155°C; Packaging: Tape and Reel; Package Quantity: 5000; Resistance Tolerance: 0.1%; Resistor Type: Thin Film; Termination: SMD/SMT; Number of Terminations: 2; Max Power Dissipation: 100mW; Features: Automotive AEC-Q200; Series: ERA; Construction: Rectangular; Technology: THIN FILM; Working Voltage: 75V; Length: 1.6mm; Width: 0.8mm; Height: 0.45mm; Depth: 0.8mm; Radiation Hardening: No; REACH SVHC: No SVHC; RoHS Compliant: Yes; Military Standard: Not; ComponentLink1URL: https://datasheet.ciiva.com/11808/0900766b80fe20f7-11808030.pdf?src-supplier=RSComponents; ComponentLink1Description: https://datasheet.ciiva.com/11808/0900766b80fe20f7-11808030.pdf?src-supplier=RSComponents; ComponentLink2URL: https://datasheet.ciiva.com/29183/451655-da-01-en-widerstand-0603-era-29183868.pdf?src-supplier=Conrad; ComponentLink2Description: https://datasheet.ciiva.com/29183/451655-da-01-en-widerstand-0603-era-29183868.pdf?src-supplier=Conrad; ComponentLink3URL: https://datasheet.ciiva.com/46388/485442-46388111.pdf?src-supplier=Element14; ComponentLink3Description: https://datasheet.ciiva.com/46388/485442-46388111.pdf?src-supplier=Element14; ComponentLink4URL: https://datasheet.ciiva.com/5734/485442-5734533.pdf?src-supplier=Farnell; ComponentLink4Description: https://datasheet.ciiva.com/5734/485442-5734533.pdf?src-supplier=Farnell; ComponentLink5URL: https://datasheet.ciiva.com/46422/485442-46422521.pdf?src-supplier=Element14; ComponentLink5Description: https://datasheet.ciiva.com/46422/485442-46422521.pdf?src-supplier=Element14; ComponentLink6URL: https://datasheet.ciiva.com/48530/era-eng-tds-48530350.pdf?src-supplier=Distrelec; ComponentLink6Description: https://datasheet.ciiva.com/48530/era-eng-tds-48530350.pdf?src-supplier=Distrelec; ComponentLink7URL: https://datasheet.ciiva.com/16724/70068849-16724943.pdf?src-supplier=Allied+Electronics; ComponentLink7Description: https://datasheet.ciiva.com/16724/70068849-16724943.pdf?src-supplier=Allied+Electronics; ComponentLink8URL: https://datasheet.ciiva.com/9186/aoa0000ce26-9186700.pdf?src-supplier=Avnet; ComponentLink8Description: https://datasheet.ciiva.com/9186/aoa0000ce26-9186700.pdf?src-supplier=Avnet; ComponentLink9URL: https://datasheet.ciiva.com/16202/aoa0000ce26-16202041.pdf?src-supplier=Future+Electronics; ComponentLink9Description: https://datasheet.ciiva.com/16202/aoa0000ce26-16202041.pdf?src-supplier=Future+Electronics; ComponentLink10URL: https://datasheet.ciiva.com/30100/54aoa0000ce26-30100782.pdf?src-supplier=Onlinecomponents.com; ComponentLink10Description: https://datasheet.ciiva.com/30100/54aoa0000ce26-30100782.pdf?src-supplier=Onlinecomponents.com
R105-R107 = CMP-2000-00122-1: Manufacturer: Panasonic; Tolerance: 0.1%; Power Rating: 100mW; Voltage Rating: 75V; Temperature Coefficient: 25ppm/°C; Part Number: ERA-3AEB751V; Supplier 1: RSComponents; Supplier Part Number 1: 6621117; Manufacturer Part Number: ERA-3AEB751V; RoHS: Yes; Category: Chip SMD Resistors; Stock 1: 1; Pricing 1: 5=0.80100, 50=0.74600, 100=0.69900, 250=0.64900, 500=0.59400 (USD); Mount: Surface Mount; Case/Package: 0603; Number of Pins: 2; Case Code (Metric): 1608; Case Code (Imperial): 0603; Contact Plating: Tin; Min Operating Temperature: -55°C; Max Operating Temperature: 155°C; Packaging: Cut Tape; Resistor Type: Thin Film; Package Quantity: 1; Number of Terminations: 2; Termination: SMD/SMT; Max Power Dissipation: 100mW; Voltage Rating (DC): 75V; Series: ERA-3A; Features: Automotive AEC-Q200; Resistance Tolerance: 0.1%; Construction: Rectangular; Technology: THIN FILM; Length: 1.6mm; Width: 0.8mm; Height: 0.45mm; Depth: 0.8mm; Radiation Hardening: No; REACH SVHC: No SVHC; RoHS Compliant: Yes; Lead Free: Lead Free; Military Standard: Not; ComponentLink1URL: https://datasheet.ciiva.com/11808/0900766b80fe20f7-11808070.pdf?src-supplier=RSComponents; ComponentLink1Description: https://datasheet.ciiva.com/11808/0900766b80fe20f7-11808070.pdf?src-supplier=RSComponents; ComponentLink2URL: https://datasheet.ciiva.com/29183/450701-da-01-en-widerstand-0603-era-29183748.pdf?src-supplier=Conrad; ComponentLink2Description: https://datasheet.ciiva.com/29183/450701-da-01-en-widerstand-0603-era-29183748.pdf?src-supplier=Conrad; ComponentLink3URL: https://datasheet.ciiva.com/48530/era-eng-tds-48530518.pdf?src-supplier=Distrelec; ComponentLink3Description: https://datasheet.ciiva.com/48530/era-eng-tds-48530518.pdf?src-supplier=Distrelec; ComponentLink4URL: https://datasheet.ciiva.com/7710/485442-7710616.pdf?src-supplier=Element14; ComponentLink4Description: https://datasheet.ciiva.com/7710/485442-7710616.pdf?src-supplier=Element14; ComponentLink5URL: https://datasheet.ciiva.com/7710/485442-7710617.pdf?src-supplier=Element14; ComponentLink5Description: https://datasheet.ciiva.com/7710/485442-7710617.pdf?src-supplier=Element14; ComponentLink6URL: https://datasheet.ciiva.com/7710/485442-7710618.pdf?src-supplier=Element14; ComponentLink6Description: https://datasheet.ciiva.com/7710/485442-7710618.pdf?src-supplier=Element14; ComponentLink7URL: https://datasheet.ciiva.com/30081/54aoa0000ce26-30081771.pdf?src-supplier=Onlinecomponents.com; ComponentLink7Description: https://datasheet.ciiva.com/30081/54aoa0000ce26-30081771.pdf?src-supplier=Onlinecomponents.com; ComponentLink8URL: https://datasheet.ciiva.com/22740/485442-22740940.pdf?src-supplier=Element14; ComponentLink8Description: https://datasheet.ciiva.com/22740/485442-22740940.pdf?src-supplier=Element14; ComponentLink9URL: https://datasheet.ciiva.com/9180/aoa0000ce26-9180142.pdf?src-supplier=Avnet; ComponentLink9Description: https://datasheet.ciiva.com/9180/aoa0000ce26-9180142.pdf?src-supplier=Avnet